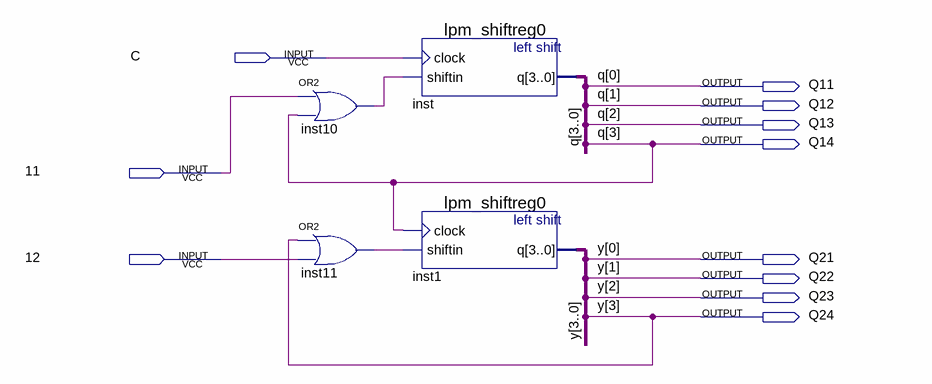
[diagram p0: schematic sheet]
// Quartus schematic v2z2.bdf as structural Verilog: 4 symbols, 11 pins
module v2z2 (
  input  C,
  input  \11 ,
  input  \12 ,
  output Q11,
  output Q12,
  output Q13,
  output Q14,
  output Q21,
  output Q22,
  output Q23,
  output Q24
);

  wire inst10_out, inst11_out;

  or inst10 (inst10_out, \11 , Q14);
  or inst11 (inst11_out, Q24, \12 );
  lpm_shiftreg0 inst (.clock(C), .shiftin(inst10_out), .q({Q14, Q13, Q12, Q11}));
  lpm_shiftreg0 inst1 (.clock(Q14), .shiftin(inst11_out), .q({Q24, Q23, Q22, Q21}));

  // Other names for the same wires on the sheet: q[3:0] = {Q14, Q13, Q12, Q11}; y[3:0] = {Q24, Q23, Q22, Q21}
endmodule
